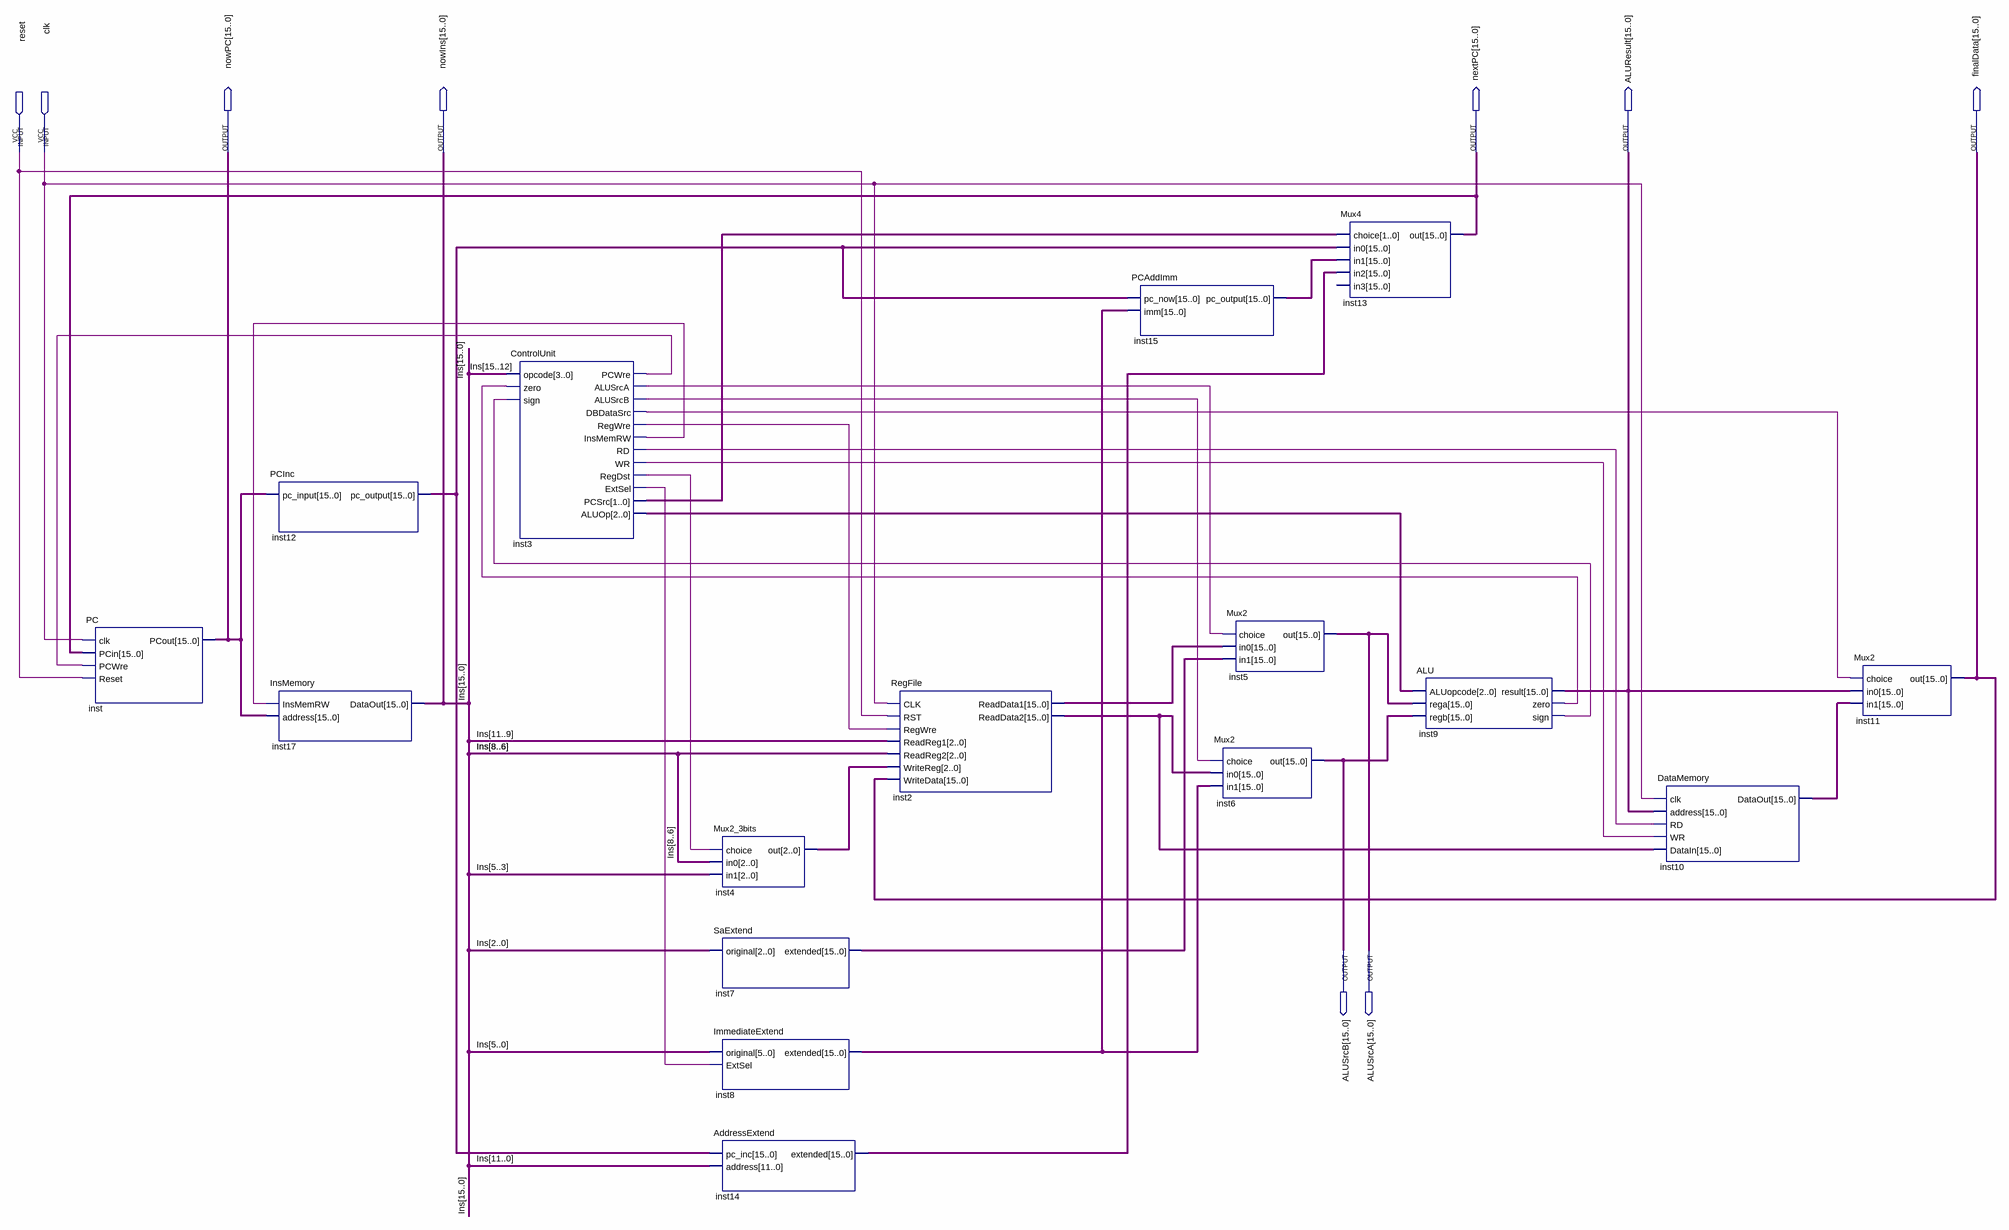
[diagram p0: schematic sheet]
// Quartus schematic CPU.bdf as structural Verilog: 16 symbols, 9 pins
module CPU (
  input  reset,
  input  clk,
  output [15:0] nowPC,
  output [15:0] nowIns,
  output [15:0] nextPC,
  output [15:0] ALUResult,
  output [15:0] finalData,
  output [15:0] ALUSrcB,
  output [15:0] ALUSrcA
);

  wire inst3_alusrca, inst3_alusrcb, inst3_dbdatasrc, inst3_extsel, inst3_insmemrw, inst3_pcwre, inst3_rd,
       inst3_regdst, inst3_regwre, inst3_wr, inst9_sign, inst9_zero;
  wire [1:0] inst3_pcsrc;
  wire [2:0] inst3_aluop, inst4_out;
  wire [15:0] inst2_readdata1, inst2_readdata2, inst7_extended, inst8_extended, inst10_dataout,
       inst12_pc_output, inst14_extended, inst15_pc_output;

  PC inst (.clk(clk), .PCin(nextPC), .PCWre(inst3_pcwre), .Reset(reset), .PCout(nowPC));
  PCInc inst12 (.pc_input(nowPC), .pc_output(inst12_pc_output));
  InsMemory inst17 (.InsMemRW(inst3_insmemrw), .address(nowPC), .DataOut(nowIns));
  ControlUnit inst3 (
    .opcode(nowIns[15:12]), .zero(inst9_zero), .sign(inst9_sign), .PCWre(inst3_pcwre),
    .ALUSrcA(inst3_alusrca), .ALUSrcB(inst3_alusrcb), .DBDataSrc(inst3_dbdatasrc), .RegWre(inst3_regwre),
    .InsMemRW(inst3_insmemrw), .RD(inst3_rd), .WR(inst3_wr), .RegDst(inst3_regdst), .ExtSel(inst3_extsel),
    .PCSrc(inst3_pcsrc), .ALUOp(inst3_aluop));
  Mux2_3bits inst4 (.choice(inst3_regdst), .in0(nowIns[8:6]), .in1(nowIns[5:3]), .out(inst4_out));
  SaExtend inst7 (.original(nowIns[2:0]), .extended(inst7_extended));
  ImmediateExtend inst8 (.original(nowIns[5:0]), .ExtSel(inst3_extsel), .extended(inst8_extended));
  AddressExtend inst14 (.pc_inc(inst12_pc_output), .address(nowIns[11:0]), .extended(inst14_extended));
  RegFile inst2 (
    .CLK(clk), .RST(reset), .RegWre(inst3_regwre), .ReadReg1(nowIns[11:9]), .ReadReg2(nowIns[8:6]),
    .WriteReg(inst4_out), .WriteData(finalData), .ReadData1(inst2_readdata1), .ReadData2(inst2_readdata2));
  PCAddImm inst15 (.pc_now(inst12_pc_output), .imm(inst8_extended), .pc_output(inst15_pc_output));
  Mux2 inst6 (.choice(inst3_alusrcb), .in0(inst2_readdata2), .in1(inst8_extended), .out(ALUSrcB));
  Mux2 inst5 (.choice(inst3_alusrca), .in0(inst2_readdata1), .in1(inst7_extended), .out(ALUSrcA));
  Mux4 inst13 (
    .choice(inst3_pcsrc), .in0(inst12_pc_output), .in1(inst15_pc_output), .in2(inst14_extended), .out(nextPC));  // open: in3
  ALU inst9 (
    .ALUopcode(inst3_aluop), .rega(ALUSrcA), .regb(ALUSrcB), .result(ALUResult), .zero(inst9_zero),
    .sign(inst9_sign));
  DataMemory inst10 (
    .clk(clk), .address(ALUResult), .RD(inst3_rd), .WR(inst3_wr), .DataIn(inst2_readdata2),
    .DataOut(inst10_dataout));
  Mux2 inst11 (.choice(inst3_dbdatasrc), .in0(ALUResult), .in1(inst10_dataout), .out(finalData));

  // Other names for the same wires on the sheet: Ins[15:0] = nowIns
endmodule
